# EAGLE schematic dcy.vca.v1.0.1.pnl (EAGLE 7.7.0)
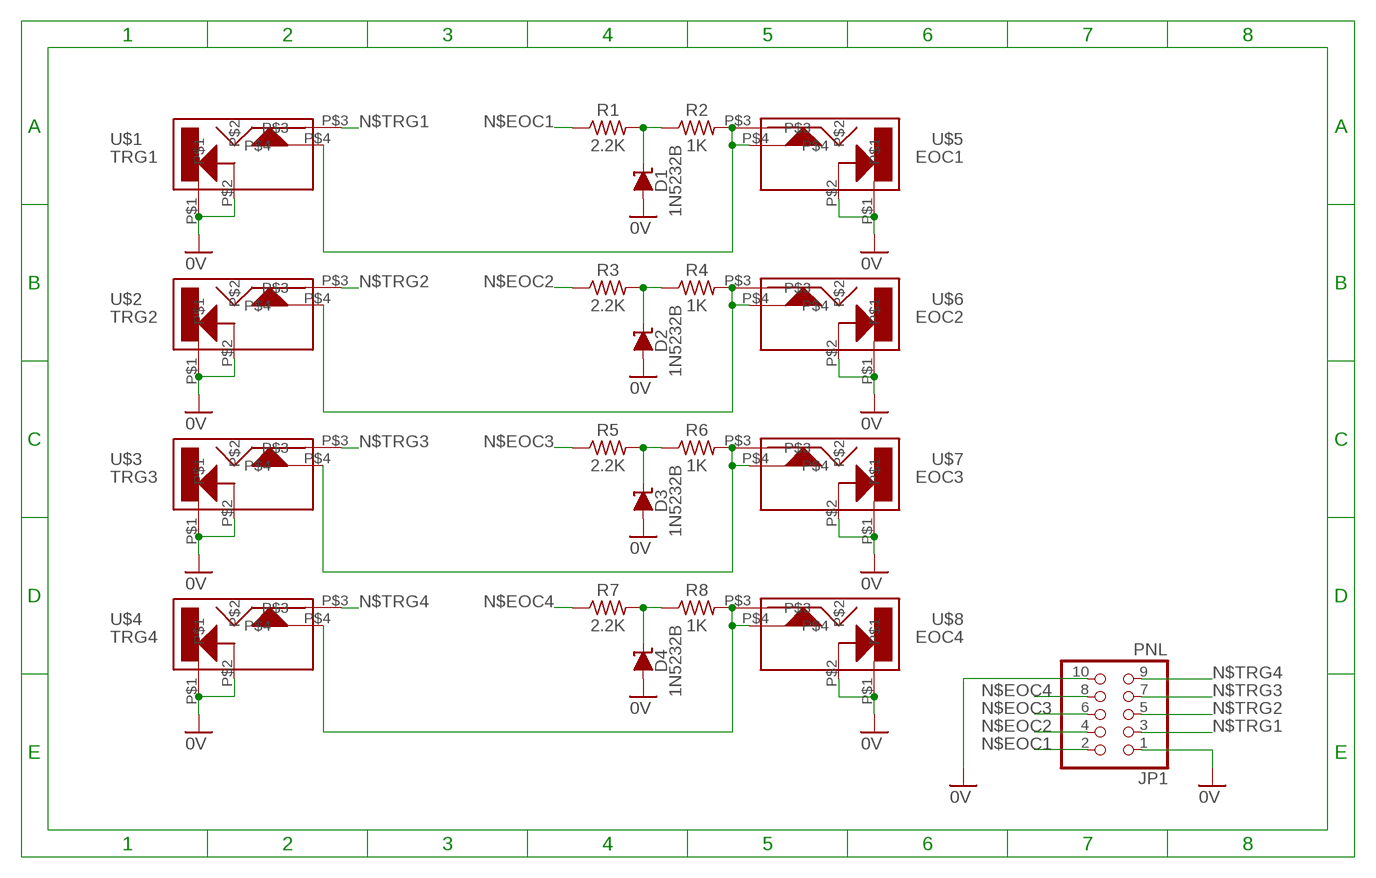
[diagram p0: schematic, sheet 1]

## Parts
D1  1N5232B  [DO34-5]
D2  1N5232B  [DO34-5]
D3  1N5232B  [DO34-5]
D4  1N5232B  [DO34-5]
JP1  PNL  PINHD-2X5  [2X05]
R1  2.2K  R  [0207/7]
R2  1K  R  [0207/7]
R3  2.2K  R  [0207/7]
R4  1K  R  [0207/7]
R5  2.2K  R  [0207/7]
R6  1K  R  [0207/7]
R7  2.2K  R  [0207/7]
R8  1K  R  [0207/7]
U$1  TRG1  CL1384  [CL1384]
U$2  TRG2  CL1384  [CL1384]
U$3  TRG3  CL1384  [CL1384]
U$4  TRG4  CL1384  [CL1384]
U$5  EOC1  CL1384  [CL1384]
U$6  EOC2  CL1384  [CL1384]
U$7  EOC3  CL1384  [CL1384]
U$8  EOC4  CL1384  [CL1384]

## Nets
0V [pwr]: D1.A D2.A D3.A D4.A JP1.1 JP1.10 U$1.P$1 U$1.P$2 U$2.P$1 U$2.P$2 U$3.P$1 U$3.P$2 U$4.P$1 U$4.P$2 U$5.P$1 U$5.P$2 U$6.P$1 U$6.P$2 U$7.P$1 U$7.P$2 U$8.P$1 U$8.P$2
N$1: D1.C R1.2 R2.1
N$2: R2.2 U$1.P$4 U$5.P$3 U$5.P$4
N$3: D2.C R3.2 R4.1
N$4: D3.C R5.2 R6.1
N$5: D4.C R7.2 R8.1
N$6: R4.2 U$2.P$4 U$6.P$3 U$6.P$4
N$7: R6.2 U$3.P$4 U$7.P$3 U$7.P$4
N$8: R8.2 U$4.P$4 U$8.P$3 U$8.P$4
N$EOC1: JP1.2 R1.1
N$EOC2: JP1.4 R3.1
N$EOC3: JP1.6 R5.1
N$EOC4: JP1.8 R7.1
N$TRG1: JP1.3 U$1.P$3
N$TRG2: JP1.5 U$2.P$3
N$TRG3: JP1.7 U$3.P$3
N$TRG4: JP1.9 U$4.P$3

## Library data of the parts
D1-D4 = _common:1N5232B: ZENER DIODE 500mW 5.6V DO-35; Zener Voltage Vz Typ:5.6V; Power Dissipation Pd:500mW; Diode Case Style:DO-35; No. of Pins:2; Operating Temperature Max:175 C;
JP1 = pinhead:PINHD-2X5: PIN HEADER
R1-R8 = _common:R: RESISTOR, US symbol
U$1-U$8 = jacks:CL1384

## Net classes
1 pwr: width 0.508 mm